# EAGLE design drone_encorder (EAGLE 7.2.0)
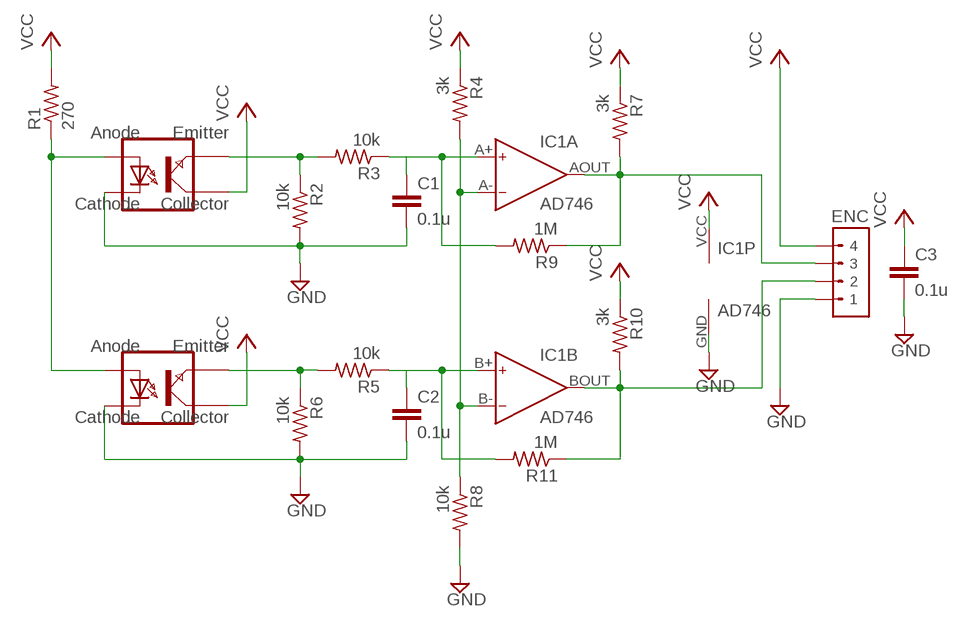
[diagram p0: schematic, sheet 1]

## Parts
C1  0.1u  C-EUC0603  [C0603]
C2  0.1u  C-EUC0603  [C0603]
C3  0.1u  C-EUC0603  [C0603]
ENC  TOP_TYPE_4PIN  [TOP_TYPE_4PIN]
IC1  AD746  [NJM2903E]
R1  270  R-US_R0603  [R0603]
R2  10k  R-US_R0603  [R0603]
R3  10k  R-US_R0603  [R0603]
R4  3k  R-US_R0603  [R0603]
R5  10k  R-US_R0603  [R0603]
R6  10k  R-US_R0603  [R0603]
R7  3k  R-US_R0603  [R0603]
R8  10k  R-US_R0603  [R0603]
R9  1M  R-US_R0603  [R0603]
R10  3k  R-US_R0603  [R0603]
R11  1M  R-US_R0603  [R0603]
U$1  TPR-105F  [TPR-105F]
U$4  TPR-105F  [TPR-105F]

## Nets
GND: C1.2 C2.2 C3.2 ENC.1 IC1.GND(P:V-) R2.2 R6.2 R8.2 U$1.CATHODE U$4.CATHODE
N$1: C1.1 IC1.A+(A:IN+) R3.1 R9.2
N$2: R1.1 U$1.ANODE U$4.ANODE
N$3: R2.1 R3.2 U$4.EMITTER
N$4: R5.2 R6.1 U$1.EMITTER
N$5: IC1.A-(A:IN-) IC1.B-(B:IN-) R4.2 R8.1
N$6: C2.1 IC1.B+(B:IN+) R5.1 R11.2
N$7: ENC.3 IC1.AOUT(A:OUT) R7.2 R9.1
N$8: ENC.2 IC1.BOUT(B:OUT) R10.2 R11.1
VCC: C3.1 ENC.4 IC1.VCC(P:V+) R1.2 R4.1 R7.1 R10.1 U$1.COLLECTOR U$4.COLLECTOR

## Library data of the parts
C1-C3 = rcl:C-EU: CAPACITOR, European symbol
ENC = GHconnector:TOP_TYPE_4PIN
IC1 = analog-devices:AD746: Dual Precision, 500 ns Settling, BiFET Op Amp Source: http://www.analog.com/static/imported-files/data_sheets/AD746.pdf
R1-R11 = rcl:R-US_: RESISTOR, American symbol
U$1 U$4 = lbr-127hld:TPR-105F

## Board
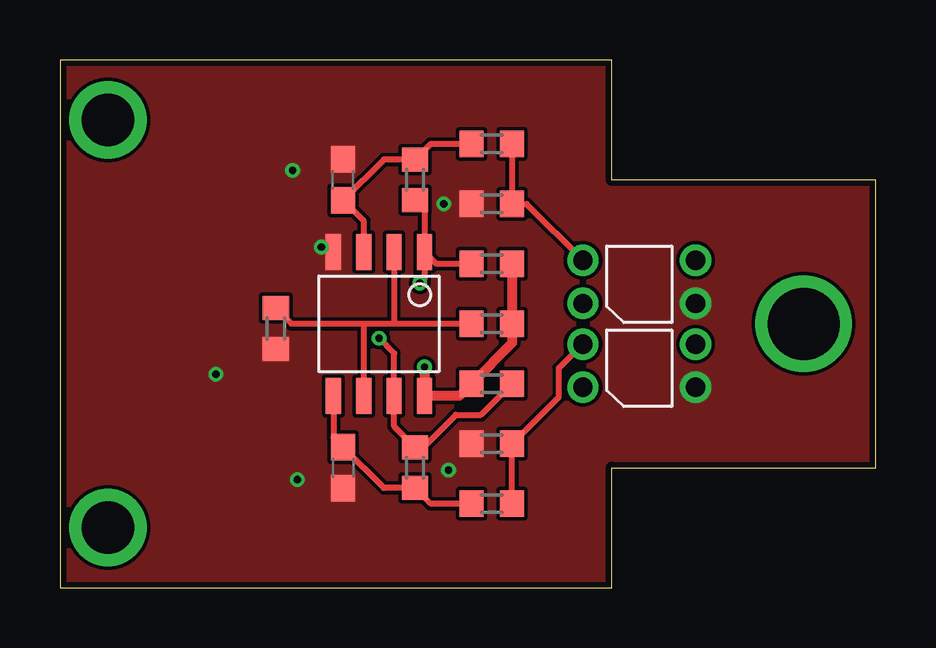
[diagram p1: board, top side]
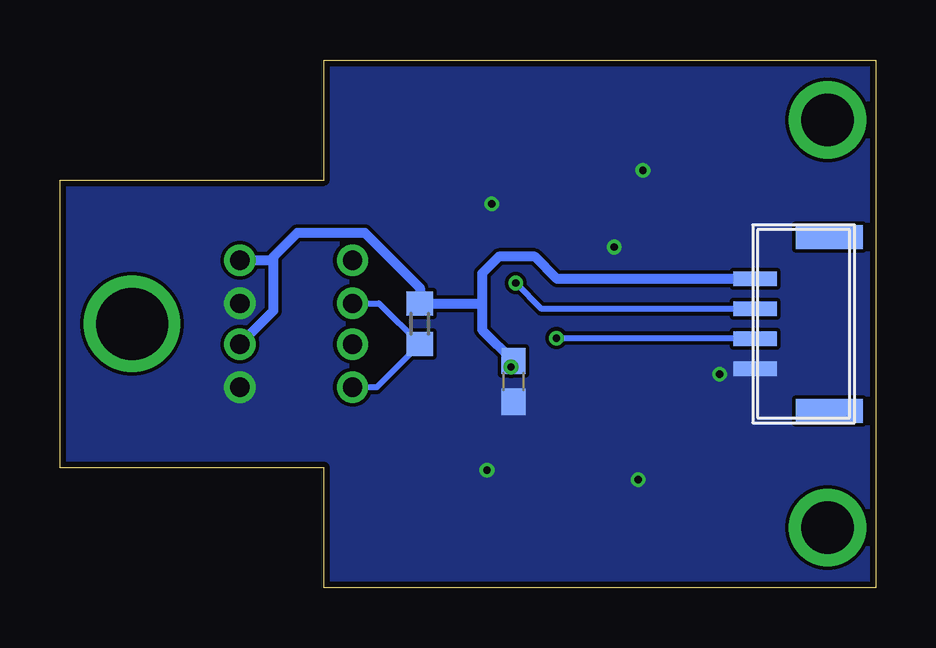
[diagram p2: board, bottom side, seen from below]

Size 34 x 22 mm. Coordinates in mm from the lower left corner, seen from the top.
Outline: 0,0 23,0 23,5 34,5 34,17 23,17 23,22 0,22 0,0
Copper layers (1*16): Top 0.035mm / dielectric 1.5mm / Bottom 0.035mm
Design rules "default *": minimum track width 6mil, minimum drill 12mil, track to track 6mil, track to pad 6mil, pad to pad 6mil, via to via 6mil, smd to smd 0mil, copper to edge 10mil, drill to drill 10mil, minimum pad ring 10mil, minimum via ring 6mil, stop-mask expansion 2mil, vias tented up to drill 0mil, thermal gap 10mil

### Footprints (pad centres in the part's own frame; a part is rotated, then mirrored left to right if it is on the bottom)
C0603 = smd 1.1 x 1: 1 -0.85,0; 2 0.85,0
TOP_TYPE_4PIN = smd 0.6 x 1.8: 1 -1.875,2.025; 2 -0.625,2.025; 3 0.625,2.025; 4 1.875,2.025 | smd 1 x 2.8: P$1 -3.625,-1.075; P$2 3.625,-1.075
NJM2903E = smd 1.5 x 0.635: A+ -3,-0.63; A- -3,0.63; AOUT -3,1.9; B+ 3,-1.9; B- 3,-0.63; BOUT 3,0.63; GND -3,-1.9; VCC 3,1.9
R0603 = smd 1 x 1.1: 1 -0.85,0; 2 0.85,0
TPR-105F = drill 0.8: ANODE 3.7,2.4; CATHODE -1,2.4; COLLECTOR -1,0.6; EMITTER 3.7,0.6

### Placement (x,y rotation side)
C1  11.8,17 90 top
C2  11.8,5 270 top
C3  15.1,8.6 270 bottom
ENC  3,11 90 bottom
IC1  13.3,11 270 top
R1  19,11 90 bottom
R2  18,16 180 top
R3  18,18.5 0 top
R4  18,11 180 top
R5  18,3.5 0 top
R6  18,6 180 top
R7  18,13.5 180 top
R8  9,10.8 270 top
R9  14.8,17 90 top
R10  18,8.5 0 top
R11  14.8,5 270 top
U$1  25.5,10.75 180 top
U$4  25.5,14.25 180 top

### Tracks (layer width: path | path; a pad name or v marks a point on that pad's centre or on a via)
GND  (via drill 0.3)
  other vias: 6.5,8.9 10.9,14.2 9.7,17.4 16,16 16.2,4.9 9.9,4.5
  pour Top (rank 6, no thermals): -5,26 40,26 40,-5 -5,-5
  pour Bottom (rank 6, no thermals): -2,25 37,25 37,-2 -2,-2
N$1
  Top 0.254: R3.1 15.45,18.5 R9.2 13.5,17.85 C1.1 12.67,15.28 IC1.A+
N$2
  Bottom 0.254: U$1.ANODE 20.8,8.35 R1.1 20.7,11.85 U$4.ANODE
N$3
  Top 0.254: R3.2 R2.1 19.45,16 U$4.EMITTER
N$4
  Top 0.254: R5.2 R6.1 20.8,7.95 20.8,9.15 U$1.EMITTER
N$5
  Top 0.254: R4.2 13.9,11 | 13.9,11 12.7,11 | IC1.B- 12.67,10.97 12.7,11 | IC1.A- 13.93,11.03 13.9,11 | 12.7,11 9.65,11 R8.1
N$6
  Top 0.254: IC1.B+ 11.4,6.25 C2.1 13.5,4.15 R11.2 15.45,3.5 R5.1
N$7  (via drill 0.3)
  Top 0.254: R7.2 15.7,13.5 IC1.AOUT | R9.1 15.2,15.75 IC1.AOUT | IC1.AOUT 15.2,12.9 v15,12.7
  Bottom 0.254: v15,12.7 13.93,11.62 ENC.3
N$8  (via drill 0.3)
  Top 0.254: R10.2 17.55,7.2 16.5,7.2 15.15,5.85 R11.1 13.93,6.72 IC1.BOUT 13.93,9.77 v13.3,10.4
  Bottom 0.254: v13.3,10.4 5.05,10.4 ENC.2
N$9  (via drill 2.2)
  other vias: 2,19.5
N$10  (via drill 2.2)
  other vias: 2,2.5
N$11  (via drill 3)
  other vias: 31,11
VCC  (via drill 0.3)
  Top 0.406: v15.2,9.2 IC1.VCC 16.65,8 R10.1 18.85,10.2 R4.1 R7.1
  Bottom 0.406: U$1.COLLECTOR 25.1,11.55 25.1,13.6 | 25.1,13.6 25.1,13.8 24.1,14.8 21.3,14.8 19,12.5 R1.2 16.45,11.85 16.4,11.9 | U$4.COLLECTOR 25.15,13.65 25.1,13.6 | v15.2,9.2 15.2,9.35 C3.1 16.4,10.75 16.4,11.9 | ENC.4 13.28,12.88 14.2,13.8 15.7,13.8 16.4,13.1 16.4,11.9